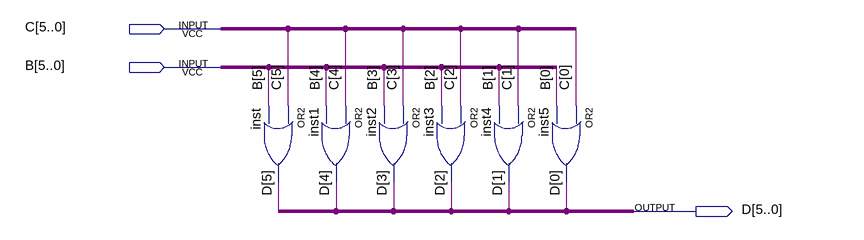
[diagram p0: schematic sheet]
// Quartus schematic or6x6.bdf as structural Verilog: 6 symbols, 3 pins
module or6x6 (
  input  [5:0] C,
  input  [5:0] B,
  output [5:0] D
);

  or inst (D[5], C[5], B[5]);
  or inst1 (D[4], C[4], B[4]);
  or inst2 (D[3], C[3], B[3]);
  or inst3 (D[2], C[2], B[2]);
  or inst4 (D[1], C[1], B[1]);
  or inst5 (D[0], C[0], B[0]);
endmodule
